# Altium schematic sheet Receiver.SchDoc
size A; SheetNumber: 8; SheetTotal: 8
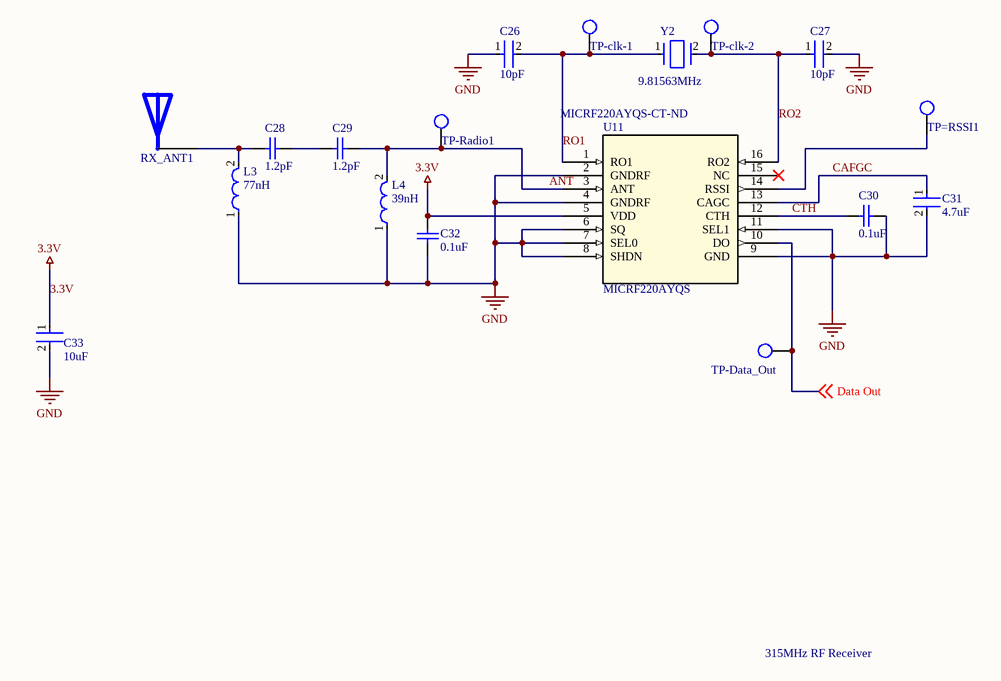
[diagram p0: Receiver.SchDoc]

## Parts
C26  10pF  [FP-C0603C-CF-MFG]
C27  10pF  [FP-C0603C-CF-MFG]
C28  1.2pF  [CAPC1005X55X25LL05T10]
C29  1.2pF  [CAPC1005X55X25LL05T10]
C30  0.1uF  [CAPC1005X56X25LL10T15]
C31  4.7uF  [FP-C1005-050-0_15-IPC_C]
C32  0.1uF  [CAPC1005X56X25LL10T15]
C33  10uF  [FP-C0805C-DG-MFG]
L3  77nH  [FP-LQW15CN_10-MFG]
L4  39nH  [FP-LQW15AN_80-MFG]
RX_ANT1  RX Antenna  [RX_Antenna]  (value not drawn)
TP-clk-1  TP_1206  [TP-SMC-1206]  (value not drawn)
TP-clk-2  TP_1206  [TP-SMC-1206]  (value not drawn)
TP-Data_Out  TP_1206  [TP-SMC-1206]  (value not drawn)
TP-Radio1  TP_1206  [TP-SMC-1206]  (value not drawn)
TP=RSSI1  TP_1206  [TP-SMC-1206]  (value not drawn)
U11  MICRF220AYQS  Supplier Part Number 1: MICRF220AYQS-CT-ND  [SOP63P600X175-16N]
Y2  9.81563MHz  [FP-ABM7-MFG]

## Nets
3.3V: C32.1 C33.1 U11.5(VDD)
GND: C26.1 C27.2 C30.2 C31.2 C32.2 C33.2 L3.1 L4.1 U11.2(GNDRF) U11.4(GNDRF) U11.6(SQ) U11.7(SEL0) U11.8(SHDN) U11.9(GND) U11.11(SEL1)
ANT: C29.2 L4.2 TP-Radio1.1 U11.3(ANT)
CAFGC: C31.1 U11.13(CAGC)
CTH: C30.1 U11.12(CTH)
Data Out: TP-Data_Out.1 U11.10(DO) ; off-sheet Data Out
RO1: C26.2 TP-clk-1.1 U11.1(RO1) Y2.1
RO2: C27.1 TP-clk-2.1 U11.16(RO2) Y2.2
NetC28_1: C28.1 L3.2 RX_ANT1.0
NetC28_2: C28.2 C29.1
NetTP=RSSI1_1: TP=RSSI1.1 U11.14(RSSI)

Not connected (* = marked no-connect by the designer): U11 15(NC)*

## Notes on the sheet
- 315MHz RF Receiver

## Library data of the parts
C26 C27 = CMP-1035-00555-3: CAP CER 10PF 50V NP0 0603; Manufacturer: KEMET; Manufacturer Part Number: C0603C100D5GACTU; Automotive Grade: Grade 1; Temperature Coefficient: 30ppm/°C; Material: Ceramic; Tolerance: 0.5 pF; Temperature Characteristic: C0G; Mouser Description: Multilayer Ceramic Capacitors MLCC - SMD/SMT 50volts 10pF C0G 0.5%; Temperature Range Low: -55°C; Height: 0.87mm; Lead Free: Yes; Device Class L3: Ceramic Capacitors; Digikey Description: CAP CER 10PF 50V NP0 0603; Temperature Range High: +125°C; RoHS: TRUE; Automotive: Yes; Temperature: -55°C to +125°C; Category: Cap; Capacitance: 10 pF; Device Class L1: Passive Components; ComponentLink2Description: Datasheet; Voltage Rating: 50 V; Device Class L2: Capacitors; Octopart: https://octopart.com/c0603c100d5gactu-kemet-9143648; Package: C0603C-CF; ComponentLink2URL: https://api.kemet.com/component-edge/download/datasheet/C0603C100J5GACAUTO.pdf; Value: 10 pF
C28 C29 = CMP-1034-00083-2: Part Number: GRM1555C1H1R2WA01D; Manufacturer: Murata
C30 C32 = CMP-2008-02743-1: Manufacturer: AVX Interconnect / Elco; Part Number: 04026D104KAT2A
C31 = CMP-08246-005457-1: CAP CER 4.7UF 6.3V X5R 0402; Dissipation Factor: 10%; Tolerance: 20%; Dielectric Material: Ceramic; Min Operating Temperature: -55°C; Construction: Flat; Voltage Rating (DC): 6.3V; Case Code (Metric): 1005; Voltage: 6.3V; Thickness: 0.026inch; Lead Free: Lead Free; Weight: 2.3E-05oz; Height: 0.5mm; Series: C; Case/Package: 0402; Capacitance: 4.7uF; Dielectric: X5R; Case Code (Imperial): 0402; Width: 0.02inch; Radiation Hardening: No; Packaging: Tape and Reel; Resistor Type: Ceramic; Termination: SMD/SMT; Max Operating Temperature: 85°C; REACH SVHC: No SVHC; Mount: Surface Mount; Package Quantity: 1; Length: 1mm; Voltage Rating: 6.3V; Depth: 0.5mm
C33 = CMP-2007-03243-2: CAP CER 10UF 10V X5R 0805; Manufacturer Part Number: C0805C106K8PACTU; Manufacturer: Kemet; 3DS Part Number: 220-00001; Tolerance: 10%; Temperature Coefficient: 15%; Material: Ceramic; Device Class L2: Capacitors; Device Class L1: Passive Components; ComponentLink2URL: https://content.kemet.com/datasheets/KEM_C1006_X5R_SMD.pdf; Height: 1.4mm; Lead Free: Yes; Digikey Description: CAP CER 10UF 10V X5R 0805; Octopart: https://octopart.com/c0805c106k8pactu-kemet-98697; Capacitance: 10uF; Value: 10uF; Temperature Range Low: -55°C; Temperature: -55°C to +85°C; Automotive: No; Mouser Description: CAP CER 10UF 10V X5R 0805; Ipc Land Pattern Name: CAPC200125X125; Temperature Range High: +85°C; Voltage: 10V; RoHS: TRUE; Device Class L3: Ceramic Capacitors; ComponentLink2Description: Datasheet; Voltage Rating: 10V; Package: C0805C-DG; Temperature Characteristic: X5R; Category: Cap
L3 = CMP-06042-006679-1: Wire Wound Ferrite RF Inductor For Automotive 77nH ±5% 1100mA 0.09Ω 0402 (1005); Self Resonant Frequency: 2GHz; Current Rating: 1.1A; DC Resistance (DCR): 90mR; Test Frequency: 100MHz; Shielding: Unshielded; Case/Package: 0402; Height - Seated (Max): 0.024inch; Inductance: 77nH; Mount: Surface Mount; Case Code (Imperial): 0402; Packaging: Tape and Reel; Width: 0.02inch; Tolerance: 5%; Case Code (Metric): 1005; Resistor Type: Wirewound; Length: 0.039inch; Core Material: Ferrite; Ratings: AEC-Q200; Min Operating Temperature: -40°C; Max Operating Temperature: 125°C
L4 = CMP-06042-001660-1: Wire Wound RF Inductor 39nH ±5% 530mA 0.456Ω 0402 (1005); Test Frequency: 100MHz; Core Material: Non-Magnetic; Q Factor: 28; Self Resonant Frequency: 3.4GHz; Shielding: Unshielded; DC Resistance (DCR): 456mR; Packaging: Tape and Reel; Mount: Surface Mount; Height: 0.5mm; Length: 0.039inch; Max DC Current: 530mA; Tolerance: 5%; Min Operating Temperature: -55°C; Current Rating: 530mA; Case Code (Imperial): 0402; Max Operating Temperature: 125°C; Width: 0.024inch; Case/Package: 0402; Package Quantity: 1; Inductance: 39nH; Height - Seated (Max): 0.024inch; Case Code (Metric): 1005; Resistor Type: Wirewound; Termination: SMD/SMT
TP-clk-1 TP-clk-2 TP-Data_Out TP-Radio1 TP=RSSI1 = TP_1206: Test Point SMD 1206; Manufacturer: TE Connectivity (Tyco Electronics); Manufacturer Part Number: 1625854-1; Resistance Value: 0 Ohm; Temperature Coefficient: N/R; Supplier: Digi-Key; Stock 1: 31937; Pricing 1: 1=0.28, 10=0.261, 25=0.224, 50=0.1902, 100=0.1828, 250=0.1641, 500=0.1567, 1000=0.1306 (USD); Case Size: 1206; Dimension: 3.2 x 1.6 x 1.25mm; Family: RC; Mounting: Surface Mount; Operating Temperature: -55 to 125 C; Part No: 1625854-1; RoHS: Yes; Packaging: Tape and Reel; Termination Style: N/R; Terminal Pitch: N/R; Power Rating: N/R; Tolerance: N/R; ComponentLink1URL: https://datasheet.ciiva.com/6439/eng-ds-1773266-a-6439169.pdf; ComponentLink1Description: https://datasheet.ciiva.com/6439/eng-ds-1773266-a-6439169.pdf; ComponentLink2URL: https://datasheet.ciiva.com/30136/1773266-a-30136341.pdf; ComponentLink2Description: https://datasheet.ciiva.com/30136/1773266-a-30136341.pdf; ComponentLink3URL: https://datasheet.ciiva.com/6439/eng-ds-1773266-a-6439080.pdf; ComponentLink3Description: https://datasheet.ciiva.com/6439/eng-ds-1773266-a-6439080.pdf; ComponentLink4URL: https://datasheet.ciiva.com/6439/eng-ds-1773266-a-6439081.pdf; ComponentLink4Description: https://datasheet.ciiva.com/6439/eng-ds-1773266-a-6439081.pdf; ComponentLink5URL: https://datasheet.ciiva.com/6439/eng-ds-1773266-a-6439083.pdf; ComponentLink5Description: https://datasheet.ciiva.com/6439/eng-ds-1773266-a-6439083.pdf; Supplier Part Number: A106143CT-ND
U11 = MICRF220AYQS: No Description Available; Mfr_Name: Microchip; Copyright: Copyright (C) 2022 Ultra Librarian. All rights reserved.; Manufacturer_Part_Number: MICRF220AYQS; RefDes: RefDes; Type: DEV; Supplier 1: Digi-Key
Y2 = CMP-27762-013605-1: Crystal 9.81563MHz ±30ppm 10pF SMD-2 6mm x 3.5mm; Frequency Stability: 100ppm; ESR (Equivalent Series Resistance): 50R; Length: 0.236inch; Packaging: Tape and Reel; Width: 0.138inch; Min Operating Temperature: -40°C; Case/Package: SMD/SMT; Height: 0.055inch; Load Capacitance: 10pF; Frequency Tolerance: 30ppm; Frequency: 9.81563MHz; Mount: Surface Mount; Max Operating Temperature: 85°C